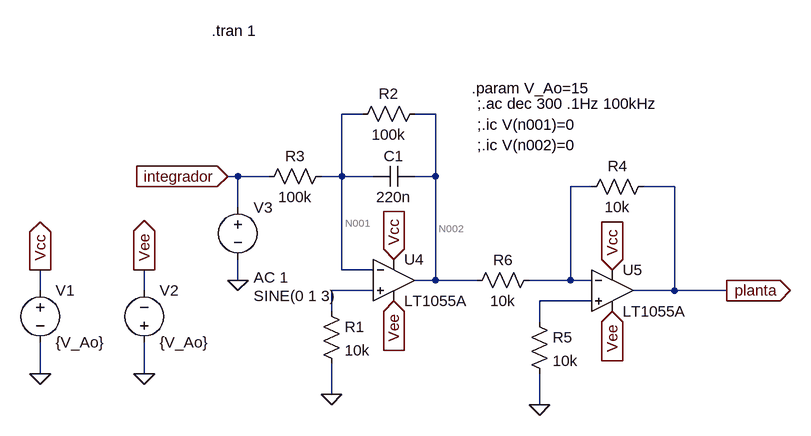
[diagram p0: schematic bloque_integrador.asc]
bloque_integrador.asc, the LTspice schematic file:
Version 4
SHEET 1 880 680
WIRE 112 -96 80 -96
WIRE 224 -96 192 -96
WIRE -80 0 -96 0
WIRE -32 0 -80 0
WIRE 80 0 80 -96
WIRE 80 0 48 0
WIRE 128 0 80 0
WIRE 224 0 224 -96
WIRE 224 0 192 0
WIRE 464 16 432 16
WIRE 592 16 544 16
WIRE -80 48 -80 0
WIRE 80 144 80 0
WIRE 128 144 80 144
WIRE -80 160 -80 128
WIRE 224 160 224 0
WIRE 224 160 192 160
WIRE 288 160 224 160
WIRE 432 160 432 16
WIRE 432 160 368 160
WIRE 464 160 432 160
WIRE -384 176 -384 144
WIRE -224 176 -224 144
WIRE 128 176 64 176
WIRE 592 176 592 16
WIRE 592 176 528 176
WIRE 672 176 592 176
WIRE 464 192 384 192
WIRE 64 208 64 176
WIRE 384 224 384 192
WIRE -384 304 -384 256
WIRE -224 304 -224 256
WIRE 64 336 64 288
WIRE 384 352 384 304
FLAG 160 128 Vcc
IOPIN 160 128 In
FLAG 160 192 Vee
IOPIN 160 192 In
FLAG 64 336 0
FLAG 496 144 Vcc
IOPIN 496 144 In
FLAG 496 208 Vee
IOPIN 496 208 In
FLAG 384 352 0
FLAG 672 176 planta
IOPIN 672 176 Out
FLAG -96 0 integrador
IOPIN -96 0 In
FLAG -384 304 0
FLAG -224 304 0
FLAG -224 144 Vee
IOPIN -224 144 Out
FLAG -384 144 Vcc
IOPIN -384 144 Out
FLAG -80 160 0
SYMBOL cap 192 -16 R90
WINDOW 0 0 32 VBottom 2
WINDOW 3 32 32 VTop 2
SYMATTR InstName C1
SYMATTR Value 220n
SYMBOL res 48 192 R0
SYMATTR InstName R1
SYMATTR Value 10k
SYMBOL res 208 -112 R90
WINDOW 0 0 56 VBottom 2
WINDOW 3 32 56 VTop 2
SYMATTR InstName R2
SYMATTR Value 100k
SYMBOL res 64 -16 R90
WINDOW 0 0 56 VBottom 2
WINDOW 3 32 56 VTop 2
SYMATTR InstName R3
SYMATTR Value 100k
SYMBOL res 560 0 R90
WINDOW 0 0 56 VBottom 2
WINDOW 3 32 56 VTop 2
SYMATTR InstName R4
SYMATTR Value 10k
SYMBOL res 368 208 R0
SYMATTR InstName R5
SYMATTR Value 10k
SYMBOL res 384 144 R90
WINDOW 0 0 56 VBottom 2
WINDOW 3 32 56 VTop 2
SYMATTR InstName R6
SYMATTR Value 10k
SYMBOL voltage -384 160 R0
SYMATTR InstName V1
SYMATTR Value {V_Ao}
SYMBOL voltage -224 272 M180
WINDOW 0 24 96 Left 2
WINDOW 3 24 16 Left 2
SYMATTR InstName V2
SYMATTR Value {V_Ao}
SYMBOL voltage -80 32 R0
WINDOW 123 24 124 Left 2
WINDOW 39 0 0 Left 0
WINDOW 3 24 152 Left 2
SYMATTR Value2 AC 1
SYMATTR InstName V3
SYMATTR Value SINE(0 1 3)
SYMBOL OpAmps\\LT1055A 160 96 R0
SYMATTR InstName U4
SYMBOL OpAmps\\LT1055A 496 112 R0
SYMATTR InstName U5
TEXT 288 -80 Left 2 !;.ic V(n001)=0
TEXT 288 -48 Left 2 !;.ic V(n002)=0
TEXT 288 -112 Left 2 !;.ac dec 300 .1Hz 100kHz
TEXT 280 -136 Left 2 !.param V_Ao=15
TEXT -120 -224 Left 2 !.tran 1

The netlist it stands for:
* bloque_integrador.asc
C1 N002 N001 220n
R1 N004 0 10k
R2 N002 N001 100k
R3 N001 integrador 100k
R4 planta N003 10k
R5 N005 0 10k
R6 N003 N002 10k
V1 Vcc 0 {V_Ao}
V2 0 Vee {V_Ao}
V3 integrador 0 SINE(0 1 3) AC 1
XU4 N004 N001 Vcc Vee N002 LT1055A  ; pins In+ In- V+ V- OUT
XU5 N005 N003 Vcc Vee planta LT1055A  ; pins In+ In- V+ V- OUT
;.ic V(n001)=0
;.ic V(n002)=0
;.ac dec 300 .1Hz 100kHz
.param V_Ao=15
.tran 1
.backanno
.end

* Results of the author's LTspice run, read from the files saved beside the schematic
* Operating Point, zero values left out:
*   V(vcc) = 15 V
*   V(vee) = -15 V
*   I(V2) = -5.6 mA
*   I(V1) = -5.6 mA
*   Ix(u4:3) = 2.8 mA
*   Ix(u4:4) = -2.8 mA
*   Ix(u5:3) = 2.8 mA
*   Ix(u5:4) = -2.8 mA
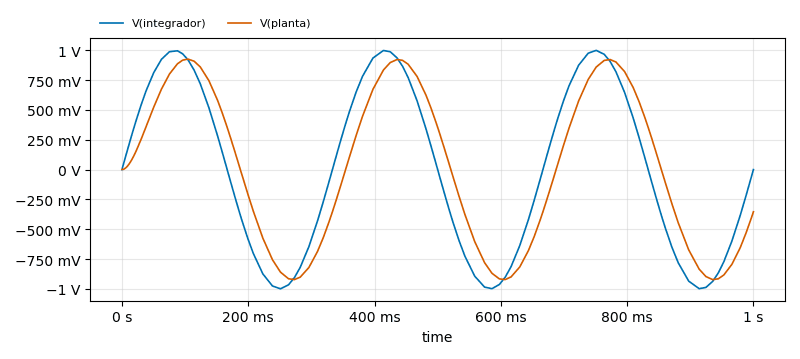
[diagram p1: Transient Analysis of bloque_integrador.asc, plotted from the saved traces]
* Transient Analysis, 1 run:
*   V(integrador): min -999.8 mV, max 999.8 mV, average 75.07 µV, rms 705.8 mV, last 0 V
*   V(planta): min -923 mV, max 926.7 mV, average 7.875 mV, rms 653.4 mV, last -353.8 mV